# Altium schematic sheet Simple Regulator Circuit.SchDoc
size A4
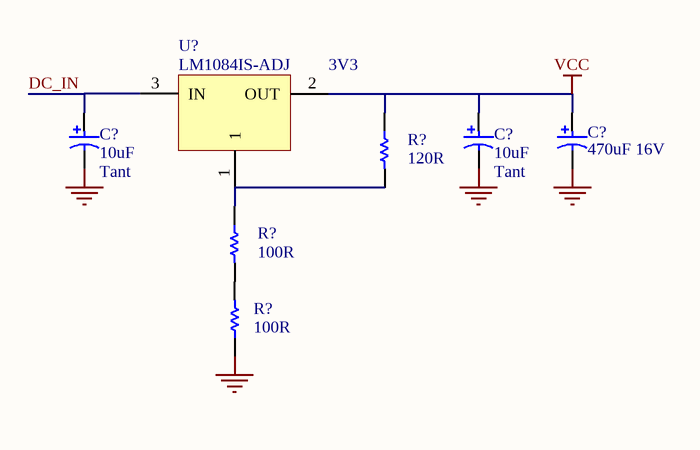
[diagram p0: Simple Regulator Circuit.SchDoc]

## Parts
(Parts that share a designator on the sheet are numbered #1, #2 ... from top to bottom, then left to right.)
C?#1  10uF  Capacitor Type: Tant  [MCCT-B]
C?#2  10uF  Capacitor Type: Tant  [MCCT-B]
C?#3  470uF 16V  [RB8/3.5]
R?#1  120R  [CC2012-0805]
R?#2  100R  [CC2012-0805]
R?#3  100R  [CC2012-0805]
U?  LM1084IS-ADJ  [TO-263]

## Nets
GND: C?#1.2 C?#2.2 C?#3.2 R?#3.1
VCC: C?#2.1 C?#3.1 R?#1.1 U?.2(OUT)
DC_IN: C?#1.1 U?.3(IN)
NetR?#1_2: R?#1.2 R?#2.1 U?.1
NetR?#2_2: R?#2.2 R?#3.2

## Notes on the sheet
- 3V3

## Library data of the parts
C?#1-C?#3 = CAP_POLAR: Polar Capacitor; Fitted: True
R?#1-R?#3 = RES: Resistor; Fitted: True
U? = LM1084IS-ADJ: 5A Low Dropout Possitive Regulators; Fitted: True